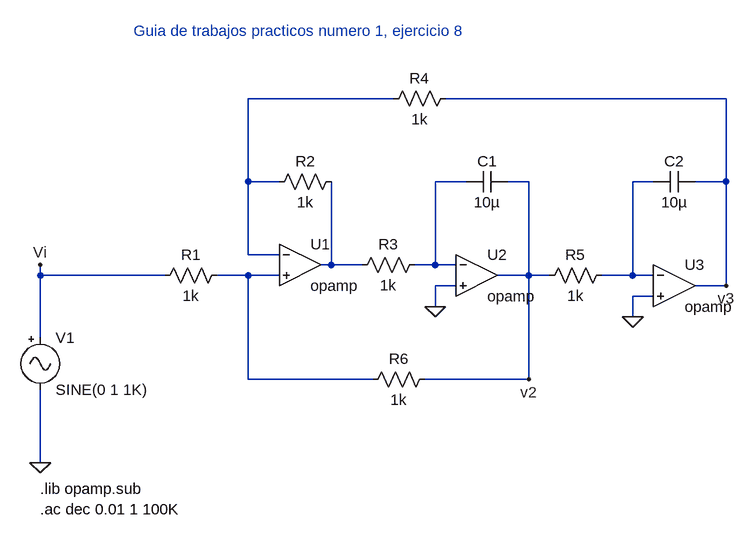
[diagram p0: schematic tp_1_8.asc]
tp_1_8.asc, the LTspice schematic file:
Version 4
SHEET 1 1100 680
WIRE 560 -32 336 -32
WIRE 1072 -32 640 -32
WIRE 336 96 336 -32
WIRE 384 96 336 96
WIRE 672 96 624 96
WIRE 768 96 736 96
WIRE 960 96 928 96
WIRE 1072 96 1072 -32
WIRE 1072 96 1024 96
WIRE 336 208 336 96
WIRE 384 208 336 208
WIRE 464 224 464 96
WIRE 464 224 448 224
WIRE 512 224 464 224
WIRE 624 224 624 96
WIRE 624 224 592 224
WIRE 656 224 624 224
WIRE 16 240 16 224
WIRE 208 240 16 240
WIRE 336 240 288 240
WIRE 384 240 336 240
WIRE 768 240 768 96
WIRE 768 240 720 240
WIRE 800 240 768 240
WIRE 928 240 928 96
WIRE 928 240 880 240
WIRE 960 240 928 240
WIRE 656 256 624 256
WIRE 1072 256 1072 96
WIRE 1072 256 1024 256
WIRE 960 272 928 272
WIRE 624 288 624 256
WIRE 928 304 928 272
WIRE 16 336 16 240
WIRE 336 400 336 240
WIRE 528 400 336 400
WIRE 768 400 768 240
WIRE 768 400 608 400
WIRE 16 528 16 416
FLAG 16 528 0
FLAG 16 224 Vi
FLAG 624 288 0
FLAG 928 304 0
FLAG 768 400 v2
FLAG 1072 256 v3
SYMBOL Misc/signal 16 320 R0
SYMATTR InstName V1
SYMATTR Value2 AC 1
SYMBOL res 304 224 R90
WINDOW 0 0 56 VBottom 2
WINDOW 3 32 56 VTop 2
SYMATTR InstName R1
SYMATTR Value 1k
SYMBOL res 480 80 R90
WINDOW 0 0 56 VBottom 2
WINDOW 3 32 56 VTop 2
SYMATTR InstName R2
SYMATTR Value 1k
SYMBOL res 608 208 R90
WINDOW 0 0 56 VBottom 2
WINDOW 3 32 56 VTop 2
SYMATTR InstName R3
SYMATTR Value 1k
SYMBOL res 656 -48 R90
WINDOW 0 0 56 VBottom 2
WINDOW 3 32 56 VTop 2
SYMATTR InstName R4
SYMATTR Value 1k
SYMBOL res 896 224 R90
WINDOW 0 0 56 VBottom 2
WINDOW 3 32 56 VTop 2
SYMATTR InstName R5
SYMATTR Value 1k
SYMBOL res 624 384 R90
WINDOW 0 0 56 VBottom 2
WINDOW 3 32 56 VTop 2
SYMATTR InstName R6
SYMATTR Value 1k
SYMBOL cap 736 80 R90
WINDOW 0 0 32 VBottom 2
WINDOW 3 32 32 VTop 2
SYMATTR InstName C1
SYMATTR Value 10µ
SYMBOL Opamps/opamp 416 160 R0
SYMATTR InstName U1
SYMBOL Opamps/opamp 688 176 R0
SYMATTR InstName U2
SYMBOL Opamps/opamp 992 192 R0
SYMATTR InstName U3
SYMBOL cap 1024 80 R90
WINDOW 0 0 32 VBottom 2
WINDOW 3 32 32 VTop 2
SYMATTR InstName C2
SYMATTR Value 10µ
TEXT 16 568 Left 2 !.lib opamp.sub
TEXT 16 600 Left 2 !.ac dec 0.01 1 100K
TEXT 160 -136 Left 2 ;Guia de trabajos practicos numero 1, ejercicio 8

The netlist it stands for:
* tp_1_8.asc
V1 Vi 0 SINE(0 1 1K) AC 1
R1 N005 Vi 1k
R2 N004 N001 1k
R3 N002 N004 1k
R4 v3 N001 1k
R5 N003 v2 1k
R6 v2 N005 1k
C1 v2 N002 10µ
XU1 N001 N005 N004 opamp Aol=100K GBW=10Meg  ; pins invin noninvin out
XU2 N002 0 v2 opamp Aol=100K GBW=10Meg  ; pins invin noninvin out
XU3 N003 0 v3 opamp Aol=100K GBW=10Meg  ; pins invin noninvin out
C2 v3 N003 10µ
.lib opamp.sub
.ac dec 0.01 1 100K
* Guia de trabajos practicos numero 1, ejercicio 8
.backanno
.end